# EAGLE design r00tz_v1 (EAGLE 7.1.0)
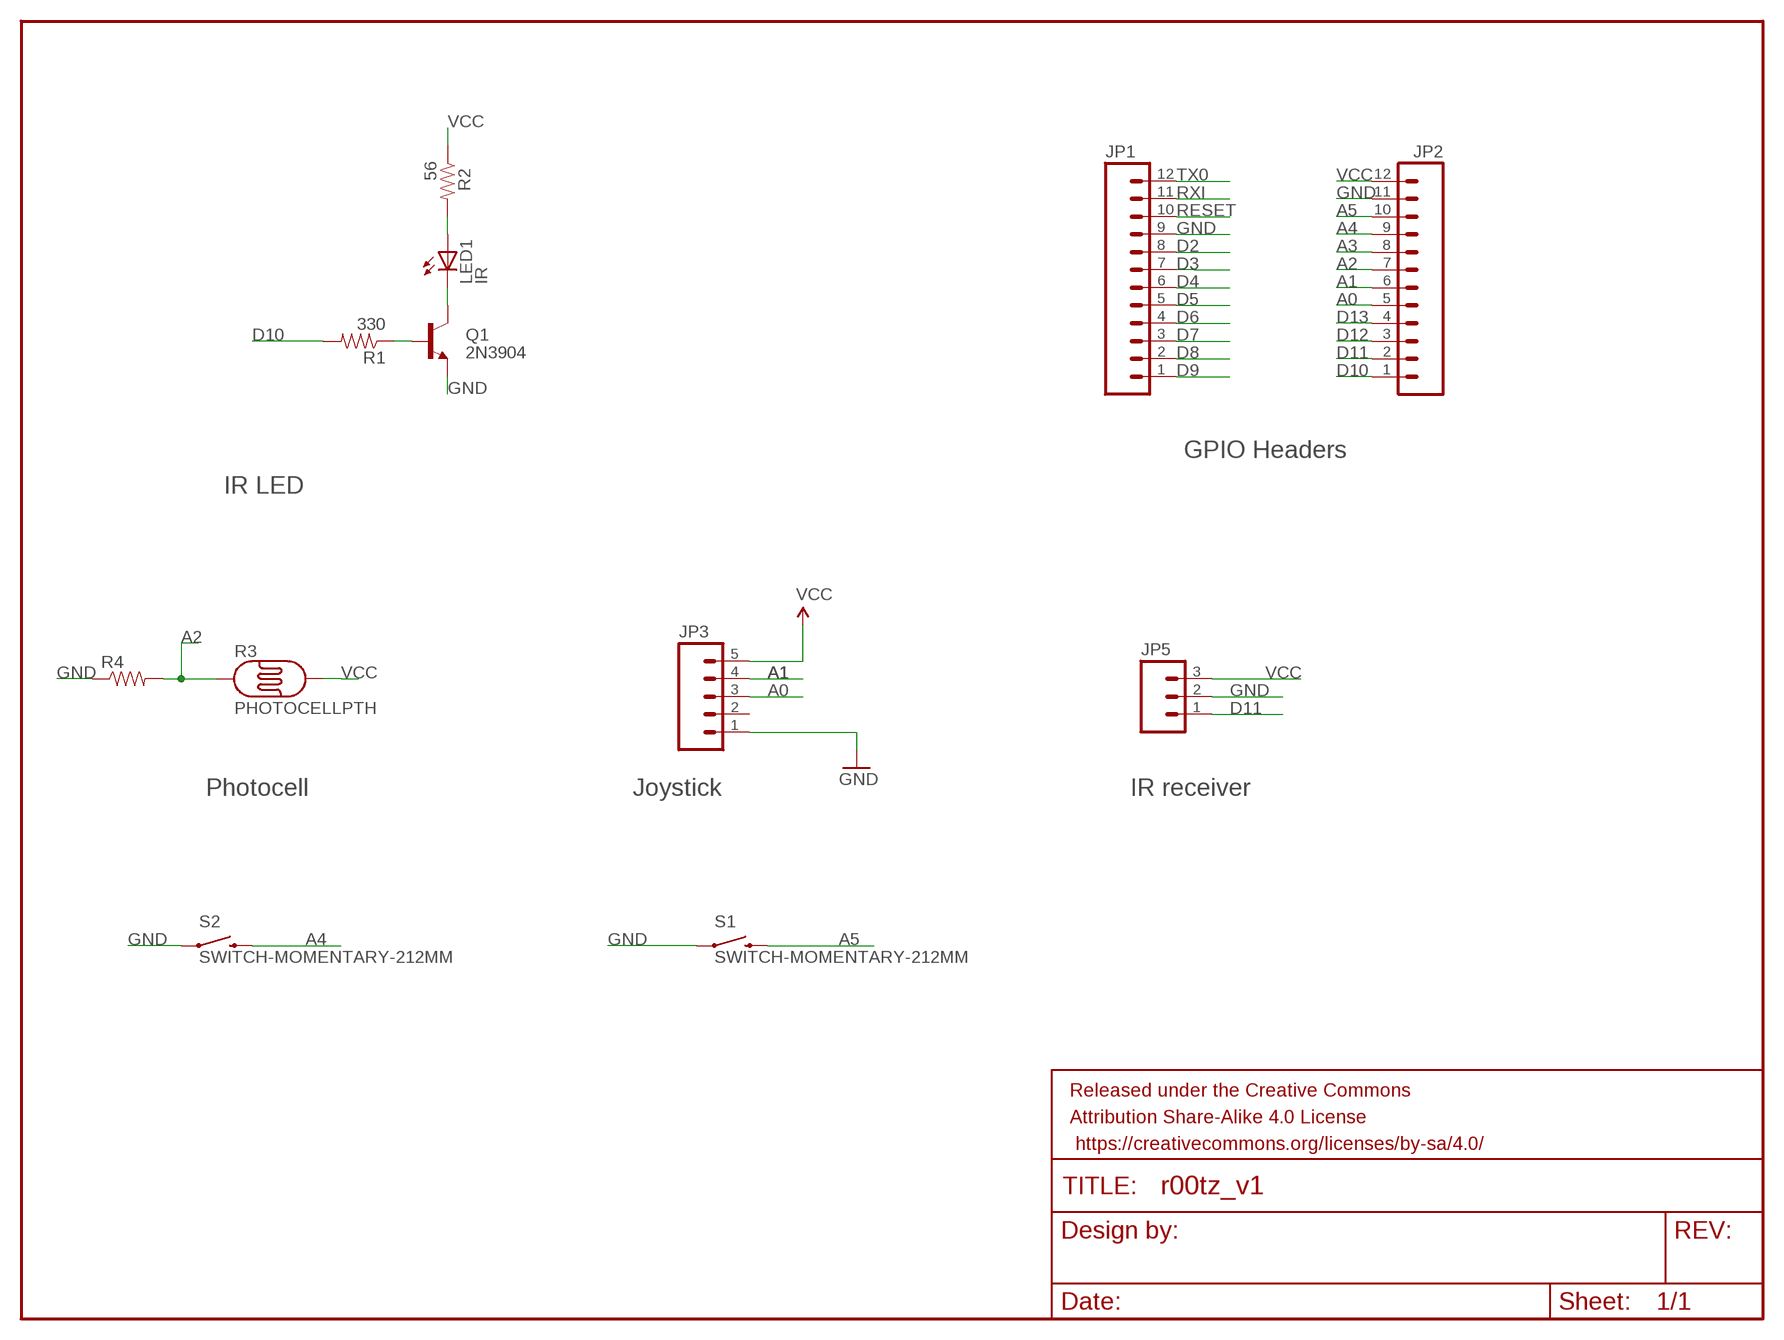
[diagram p0: schematic, sheet 1]

## Parts
FRAME1  FRAME-LETTER  [CREATIVE_COMMONS]
JP1  M12PTH  [1X12]
JP2  M12PTH  [1X12]
JP3  M05PTH  [1X05]
JP5  M03PTH  [1X03]
LED1  IR  LED5MM  [LED5MM]
Q1  2N3904  TRANSISTOR_NPNTO92  [TO-92]
R1  330  RESISTORAXIAL-0.3  [AXIAL-0.3]
R2  56  RESISTORAXIAL-0.3  [AXIAL-0.3]
R3  PHOTOCELLPTH  [PHOTOCELL]
R4  10KOHM-1/6W-5%(PTH)KIT  [AXIAL-0.3-KIT]
S1  SWITCH-MOMENTARY-212MM  [TACTILE-PTH-12MM]
S2  SWITCH-MOMENTARY-212MM  [TACTILE-PTH-12MM]

## Nets
A0: JP2.5 JP3.3
A1: JP2.6 JP3.4
A2: JP2.7 R3.1 R4.P$2
A3: JP2.8
A4: JP2.9 S2.3
A5: JP2.10 S1.3
D2: JP1.8
D3: JP1.7
D4: JP1.6
D5: JP1.5
D6: JP1.4
D7: JP1.3
D8: JP1.2
D9: JP1.1
D10: JP2.1 R1.P$2
D11: JP2.2 JP5.1
D12: JP2.3
D13: JP2.4
GND: JP1.9 JP2.11 JP3.1 JP5.2 Q1.1(E) R4.P$1 S1.1 S2.1
N$1: LED1.K(C) Q1.3(C)
N$2: Q1.2(B) R1.P$1
N$5: LED1.A R2.P$2
RESET: JP1.10
RXI: JP1.11
TX0: JP1.12
VCC [vcc]: JP2.12 JP3.5 JP5.3 R2.P$1 R3.2
Unconnected: JP3.2

## Notes on the sheet
- GPIO Headers
- IR LED
- Photocell | Joystick | IR receiver

## Library data of the parts
FRAME1 = SparkFun-Aesthetics:FRAME-LETTER: Schematic Frame Standard 8.5x11 US Letter frame; DESIGNER: NAME; VERSION: v01
JP1 JP2 = SparkFun-Connectors:M12: Header 12 Standard 12-pin 0.1" header. Use with straight break away headers (SKU : PRT-00116), right angle break away headers (PRT-00553), swiss pins (PRT-00743), machine pins (PRT-00117), and female headers (PRT-00115).
JP3 = SparkFun-Connectors:M05: Header 5 Standard 5-pin 0.1" header. Use with straight break away headers (SKU : PRT-00116), right angle break away headers (PRT-00553), swiss pins (PRT-00743), machine pins (PRT-00117), and female headers (PRT-00115). Molex polarized connector foot print use with SKU : PRT-08230 with associated crimp pins and housings.
JP5 = SparkFun-Connectors:M03: Header 3 Standard 3-pin 0.1" header. Use with straight break away headers (SKU : PRT-00116), right angle break away headers (PRT-00553), swiss pins (PRT-00743), machine pins (PRT-00117), and female headers (PRT-00115). Molex polarized connector foot print use with SKU : PRT-08232 with associated crimp pins and housings.
LED1 = SparkFun:LED: LEDs Standard schematic elements and footprints for 5mm, 3mm, 1206, and 0603 sized LEDs. 5mm - Spark Fun Electronics SKU : COM-00529 (and others)
Q1 = SparkFun:TRANSISTOR_NPN: Transistor NPN BJT configuration in SOT23 package. MMBT2222 is the common NPN we use. Double check BCE configuration again layout.
R1 R2 = SparkFun:RESISTOR: Resistor Basic schematic elements and footprints for 0603, 1206, and PTH resistors.
R3 = SparkFun-Sensors:PHOTOCELL: CdS photoresistor. This is a low cost way to detect light levels. Resistance decreases with more incoming light. SparkFun SKU: SEN-09088
R4 = SparkFun-Resistors:10KOHM-1/6W-5%(PTH): RES-08375; PROD_ID: RES-08375
S1 S2 = SparkFun-Electromechanical:SWITCH-MOMENTARY-2: Various NO switches- pushbuttons, reed, etc; PROD_ID: SWCH-09185

## Net classes
1 vcc: width 0.254 mm

## Board
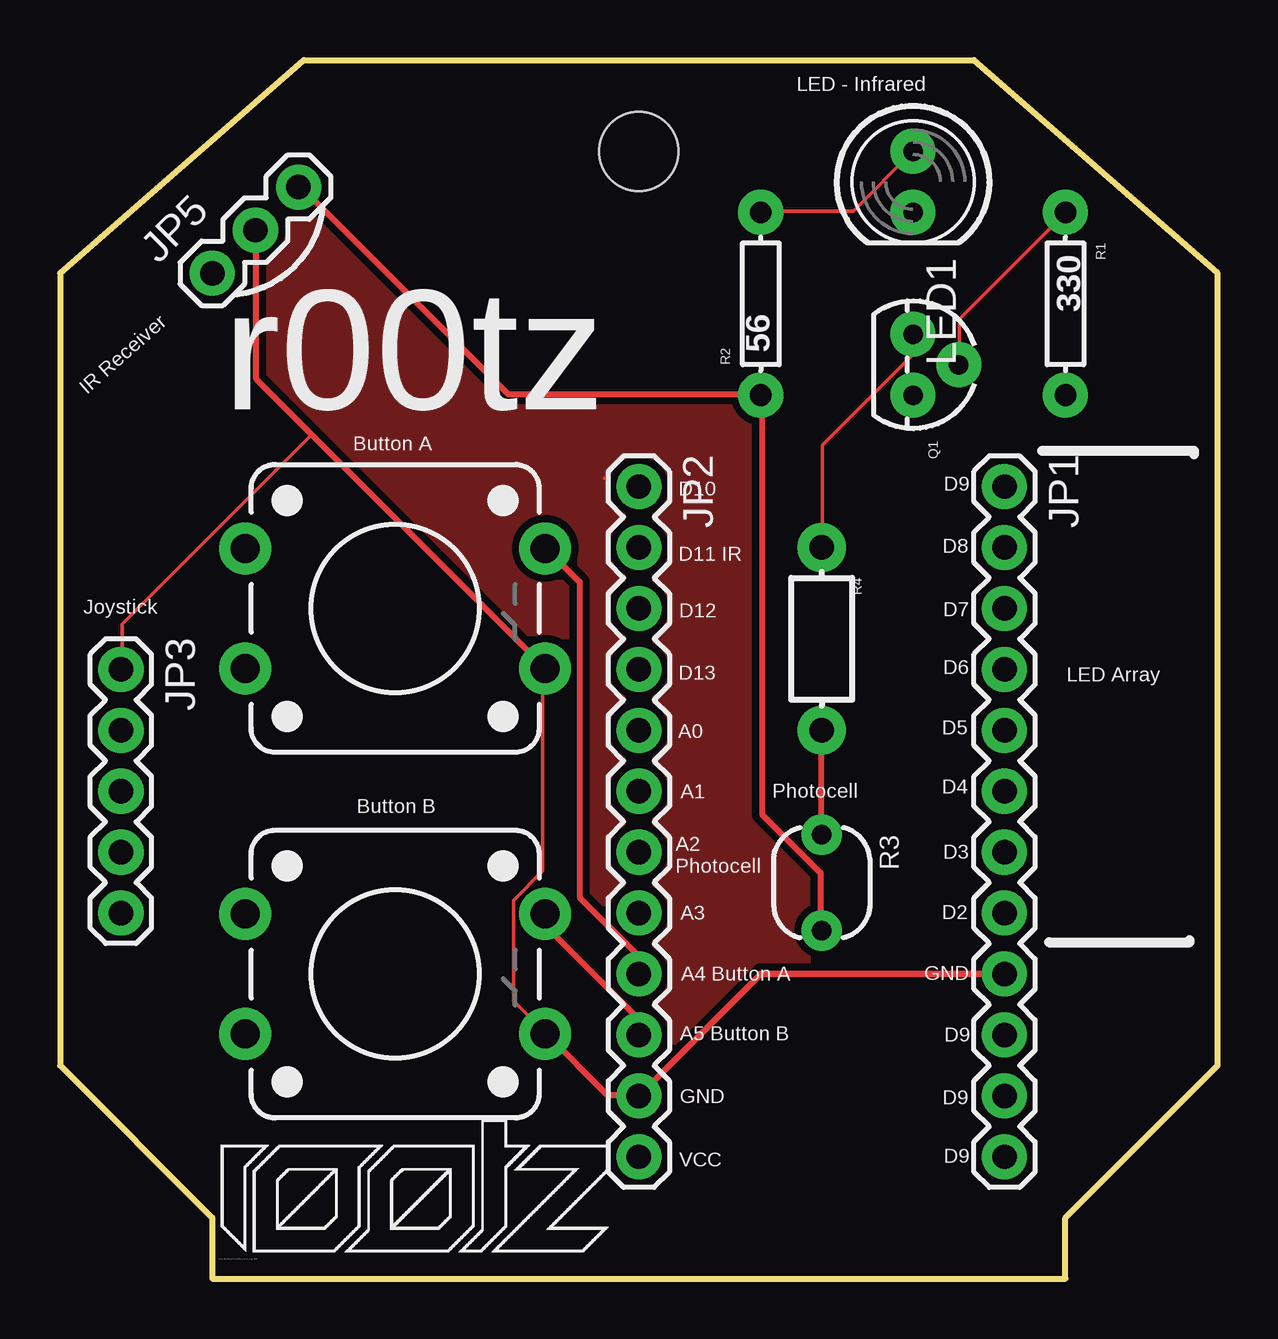
[diagram p1: board, top side]
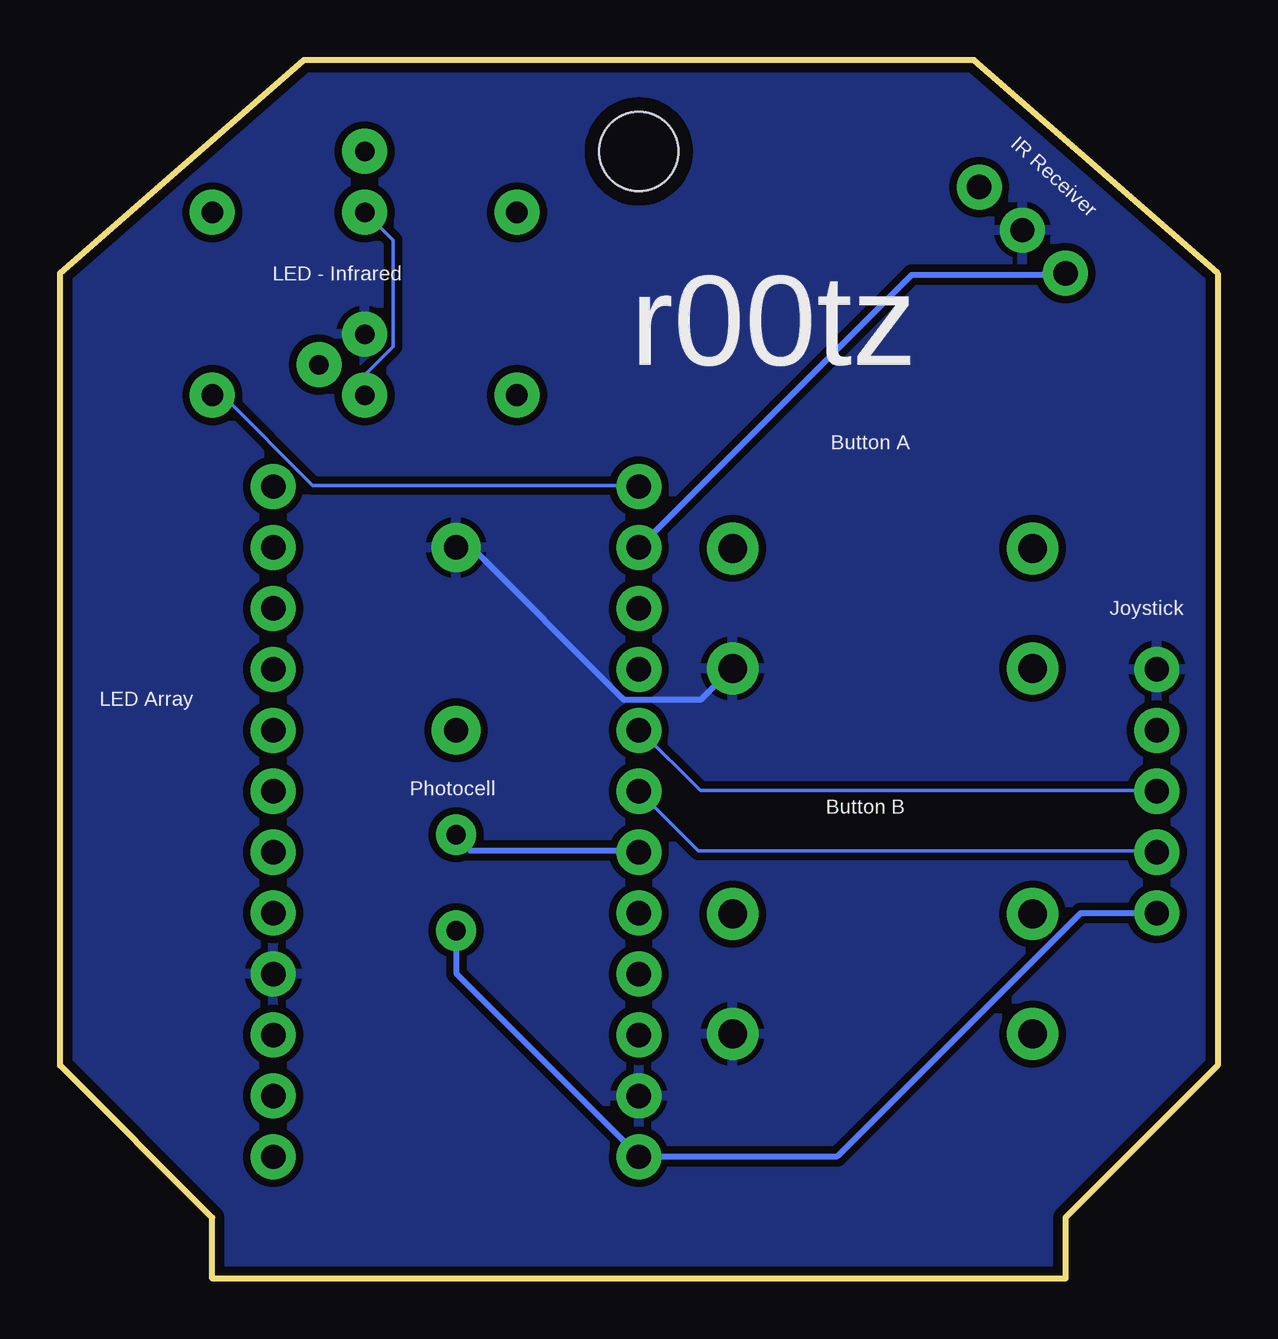
[diagram p2: board, bottom side, seen from below]

Size 48.26 x 50.8 mm. Coordinates in mm from the lower left corner, seen from the top.
Outline: 0,41.91 10.16,50.8 38.1,50.8 48.26,41.91 48.26,8.89 41.91,2.54 41.91,0 6.35,0 6.35,2.54 0,8.89 0,41.91
Copper layers (1*16): Top 0.0356mm / dielectric 1.5011mm / Bottom 0.0356mm
Design rules "LaenPCBOrder": minimum track width 6mil, minimum drill 13mil, track to track 6mil, track to pad 6mil, pad to pad 6mil, via to via 6mil, smd to smd 6mil, copper to edge 15mil, drill to drill 6mil, minimum pad ring 7mil, minimum via ring 7mil, stop-mask expansion 3mil, vias tented up to drill 0mil, thermal gap 10mil

### Footprints (pad centres in the part's own frame; a part is rotated, then mirrored left to right if it is on the bottom)
1X12 = drill 1.016 pad 1.88: 1 0,0; 2 2.54,0; 3 5.08,0; 4 7.62,0; 5 10.16,0; 6 12.7,0; 7 15.24,0; 8 17.78,0; 9 20.32,0; 10 22.86,0; 11 25.4,0; 12 27.94,0
1X05 = drill 1.016 pad 1.88: 1 0,0; 2 2.54,0; 3 5.08,0; 4 7.62,0; 5 10.16,0
1X03 = drill 1.016 pad 1.88: 1 0,0; 2 2.54,0; 3 5.08,0
LED5MM = drill 0.813 pad 1.88: A -1.27,0; K 1.27,0
TO-92 = drill 0.813 pad 1.88: 1 -1.27,0; 2 0,1.905; 3 1.27,0
AXIAL-0.3 = drill 0.9 pad 1.88: P$1 -3.81,0; P$2 3.81,0
PHOTOCELL = drill 0.8 pad 1.676: 1 -2,0; 2 2,0
AXIAL-0.3-KIT = drill 1.016 pad 2.032: P$1 -3.81,0; P$2 3.81,0
TACTILE-PTH-12MM = drill 1.2 pad 2.159: 1 6.25,-2.5; 2 -6.25,-2.5; 3 6.25,2.5; 4 -6.25,2.5
STAND-OFF = hole 3.302: 0,0

### Placement (x,y rotation side)
FRAME1  21.59,-8.89 0 top  (outside the outline)
JP1  39.37,33.02 270 top
JP2  24.13,33.02 270 top
JP3  2.54,25.4 270 top
JP5  6.35,41.91 45 top
LED1  35.56,45.72 270 top
Q1  35.56,38.1 270 top
R1  41.91,40.64 270 top
R2  29.21,40.64 90 top
R3  31.75,16.51 270 top
R4  31.75,26.67 270 top
S1  13.97,12.7 0 top
S2  13.97,27.94 0 top
U$1  [STAND-OFF]  24.13,46.99 0 top

### Tracks (layer width: path | path; a pad name or v marks a point on that pad's centre or on a via)
A0
  Bottom 0.152: JP3.3 2.59,20.34 21.57,20.34 24.08,22.86 JP2.5
A1
  Bottom 0.152: JP2.6 21.64,17.83 2.59,17.83 JP3.4
A2
  Top 0.254: R3.1 31.73,18.53 31.73,22.76 R4.P$2
  Bottom 0.254: JP2.7 24.18,17.84 31.15,17.84 31.73,18.41 R3.1
A4
  Top 0.254: JP2.9 24.07,12.7 24.07,13.5 21.67,15.9 21.67,29.05 20.3,30.42 S2.3
A5
  Top 0.254: JP2.10 24.07,10.19 24.07,10.87 20.3,14.64 20.3,15.1 S1.3
D10
  Bottom 0.152: JP2.1 24.16,33.07 37.72,33.07 41.45,36.8 41.91,36.8 R1.P$2
D11
  Bottom 0.254: JP5.1 6.35,41.85 12.75,41.85 24.07,30.53 JP2.2
GND
  Top 0.152: Q1.1 35.51,39.32 35.51,38.48 31.77,34.75 31.77,30.48 R4.P$1 | 10.5,35.19 2.59,27.28 2.59,25.45 JP3.1 | S2.1 20.12,25.38 20.12,16.99 18.9,15.77 18.9,11.58 20.19,10.29 S1.1
  Top 0.254: JP5.2 8.18,43.67 8.18,37.5 10.5,35.19 20.18,25.5 S2.1 | S1.1 20.3,10.19 22.81,7.67 24.07,7.67 JP2.11 29.21,12.7 | 29.21,12.7 JP1.9 29.21,12.7 | 29.21,12.72 39.37,12.72
  Bottom 0.254: R4.P$1 31.38,30.76 24.75,24.13 21.55,24.13 20.3,25.39 S2.1
  pour Bottom (isolate 0.305): 6.35,0 6.35,2.54 0,8.89 0,41.91 5.08,45.72 10.16,50.8 38.1,50.8 41.91,46.99 48.26,41.91 48.26,8.89 41.91,2.54 41.91,0
N$1
  Bottom 0.152: Q1.3 35.51,36.88 35.51,37.72 34.37,38.86 34.37,43.28 35.51,44.42 LED1.K
N$2
  Top 0.152: Q1.2 37.49,38.1 37.49,40.01 41.91,44.42 R1.P$1
N$3
  Top 0.152: 22.86,33.3 22.7,33.36
  pour Top (isolate 0.305): 6.35,0 6.35,2.54 0,8.89 0,41.91 6.35,46.99 10.16,50.8 38.1,50.8 43.18,45.72 48.26,41.91 48.26,8.89 41.91,2.54 41.91,0
N$5
  Top 0.152: LED1.A 33.07,44.5 29.26,44.5 R2.P$2
VCC
  Top 0.254: JP5.3 10.06,45.49 18.67,36.88 29.18,36.88 R2.P$1 29.26,36.73 29.26,19.36 31.7,16.92 31.7,14.55 R3.2
  Bottom 0.254: R3.2 31.73,14.41 31.73,12.7 24.18,5.16 JP2.12 24,5.11 15.85,5.11 5.71,15.24 JP3.5

### Text on the board
tPlace: LED - Infrared | IR Receiver | r00tz | Button A | D10 | D9 | D8 | D11 IR | Joystick | D12 | D7 | D6 | D13 | LED Array | A0 | D5 | D4 | A1 | Photocell | Button B | D3 | A2 / Photocell | D2 | A3 | GND | A4 Button A | A5 Button B | D9 | D9 | GND | VCC | D9 | /Users/Work/Downloads/r00tz_asylum_logo.BMP
bPlace: IR Receiver | LED - Infrared | r00tz | Button A | Joystick | LED Array | Photocell | Button B